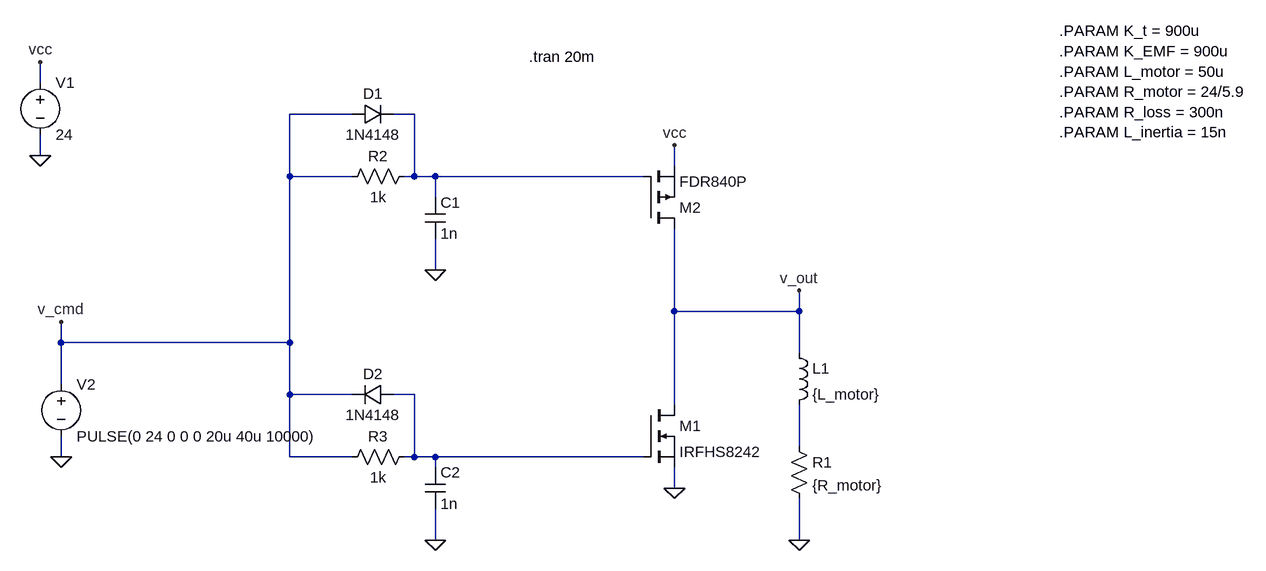
[diagram p0: schematic motor_drive_01.asc]
motor_drive_01.asc, the LTspice schematic file:
Version 4
SHEET 1 1444 852
WIRE -416 -16 -416 -48
WIRE 64 32 -32 32
WIRE 160 32 128 32
WIRE -416 96 -416 64
WIRE 560 112 560 80
WIRE -32 128 -32 32
WIRE 64 128 -32 128
WIRE 160 128 160 32
WIRE 160 128 144 128
WIRE 192 128 160 128
WIRE 512 128 192 128
WIRE 192 160 192 128
WIRE 192 272 192 224
WIRE 560 336 560 208
WIRE 752 336 752 304
WIRE 752 336 560 336
WIRE -384 384 -384 352
WIRE -32 384 -32 128
WIRE -32 384 -384 384
WIRE 752 400 752 336
WIRE -384 448 -384 384
WIRE -32 464 -32 384
WIRE 64 464 -32 464
WIRE 160 464 128 464
WIRE 560 480 560 336
WIRE 752 544 752 480
WIRE -384 560 -384 528
WIRE -32 560 -32 464
WIRE 64 560 -32 560
WIRE 160 560 160 464
WIRE 160 560 144 560
WIRE 192 560 160 560
WIRE 512 560 192 560
WIRE 192 576 192 560
WIRE 560 608 560 576
WIRE 192 688 192 640
WIRE 752 688 752 624
FLAG -416 -48 vcc
FLAG -416 96 0
FLAG -384 560 0
FLAG 560 608 0
FLAG 560 80 vcc
FLAG 192 272 0
FLAG 192 688 0
FLAG 752 688 0
FLAG -384 352 v_cmd
FLAG 752 304 v_out
SYMBOL voltage -416 -32 R0
SYMATTR InstName V1
SYMATTR Value 24
SYMBOL nmos 512 480 R0
SYMATTR InstName M1
SYMATTR Value IRFHS8242
SYMBOL pmos 512 208 M180
SYMATTR InstName M2
SYMATTR Value FDR840P
SYMBOL voltage -384 432 R0
WINDOW 123 0 0 Left 2
WINDOW 39 0 0 Left 2
SYMATTR InstName V2
SYMATTR Value PULSE(0 24 0 0 0 20u 40u 10000)
SYMBOL res 160 112 R90
WINDOW 0 0 56 VBottom 2
WINDOW 3 32 56 VTop 2
SYMATTR InstName R2
SYMATTR Value 1k
SYMBOL cap 176 160 R0
SYMATTR InstName C1
SYMATTR Value 1n
SYMBOL diode 64 48 R270
WINDOW 0 32 32 VTop 2
WINDOW 3 0 32 VBottom 2
SYMATTR InstName D1
SYMATTR Value 1N4148
SYMBOL res 160 544 R90
WINDOW 0 0 56 VBottom 2
WINDOW 3 32 56 VTop 2
SYMATTR InstName R3
SYMATTR Value 1k
SYMBOL cap 176 576 R0
SYMATTR InstName C2
SYMATTR Value 1n
SYMBOL diode 128 448 R90
WINDOW 0 0 32 VBottom 2
WINDOW 3 32 32 VTop 2
SYMATTR InstName D2
SYMATTR Value 1N4148
SYMBOL ind 736 384 R0
SYMATTR InstName L1
SYMATTR Value {L_motor}
SYMBOL res 736 528 R0
SYMATTR InstName R1
SYMATTR Value {R_motor}
TEXT 336 -56 Left 2 !.tran 20m
TEXT 1152 -96 Left 2 !.PARAM K_t = 900u\n.PARAM K_EMF = 900u\n.PARAM L_motor = 50u\n.PARAM R_motor = 24/5.9\n.PARAM R_loss = 300n\n.PARAM L_inertia = 15n

The netlist it stands for:
* motor_drive_01.asc
V1 vcc 0 24
M1 v_out N002 0 0 IRFHS8242
M2 v_out N001 vcc vcc FDR840P
V2 v_cmd 0 PULSE(0 24 0 0 0 20u 40u 10000)
R2 N001 v_cmd 1k
C1 N001 0 1n
D1 v_cmd N001 1N4148
R3 N002 v_cmd 1k
C2 N002 0 1n
D2 N002 v_cmd 1N4148
L1 v_out N003 {L_motor}
R1 N003 0 {R_motor}
.model D D
.lib standard.dio
.model NMOS NMOS
.model PMOS PMOS
.lib standard.mos
.tran 20m
.PARAM K_t = 900u
.PARAM K_EMF = 900u
.PARAM L_motor = 50u
.PARAM R_motor = 24/5.9
.PARAM R_loss = 300n
.PARAM L_inertia = 15n
.backanno
.end